# Altium project WS7.820.438.V01.PrjPCB (part 2 of 2)

## Sheet 4-RF-PD.SchDoc
size A2
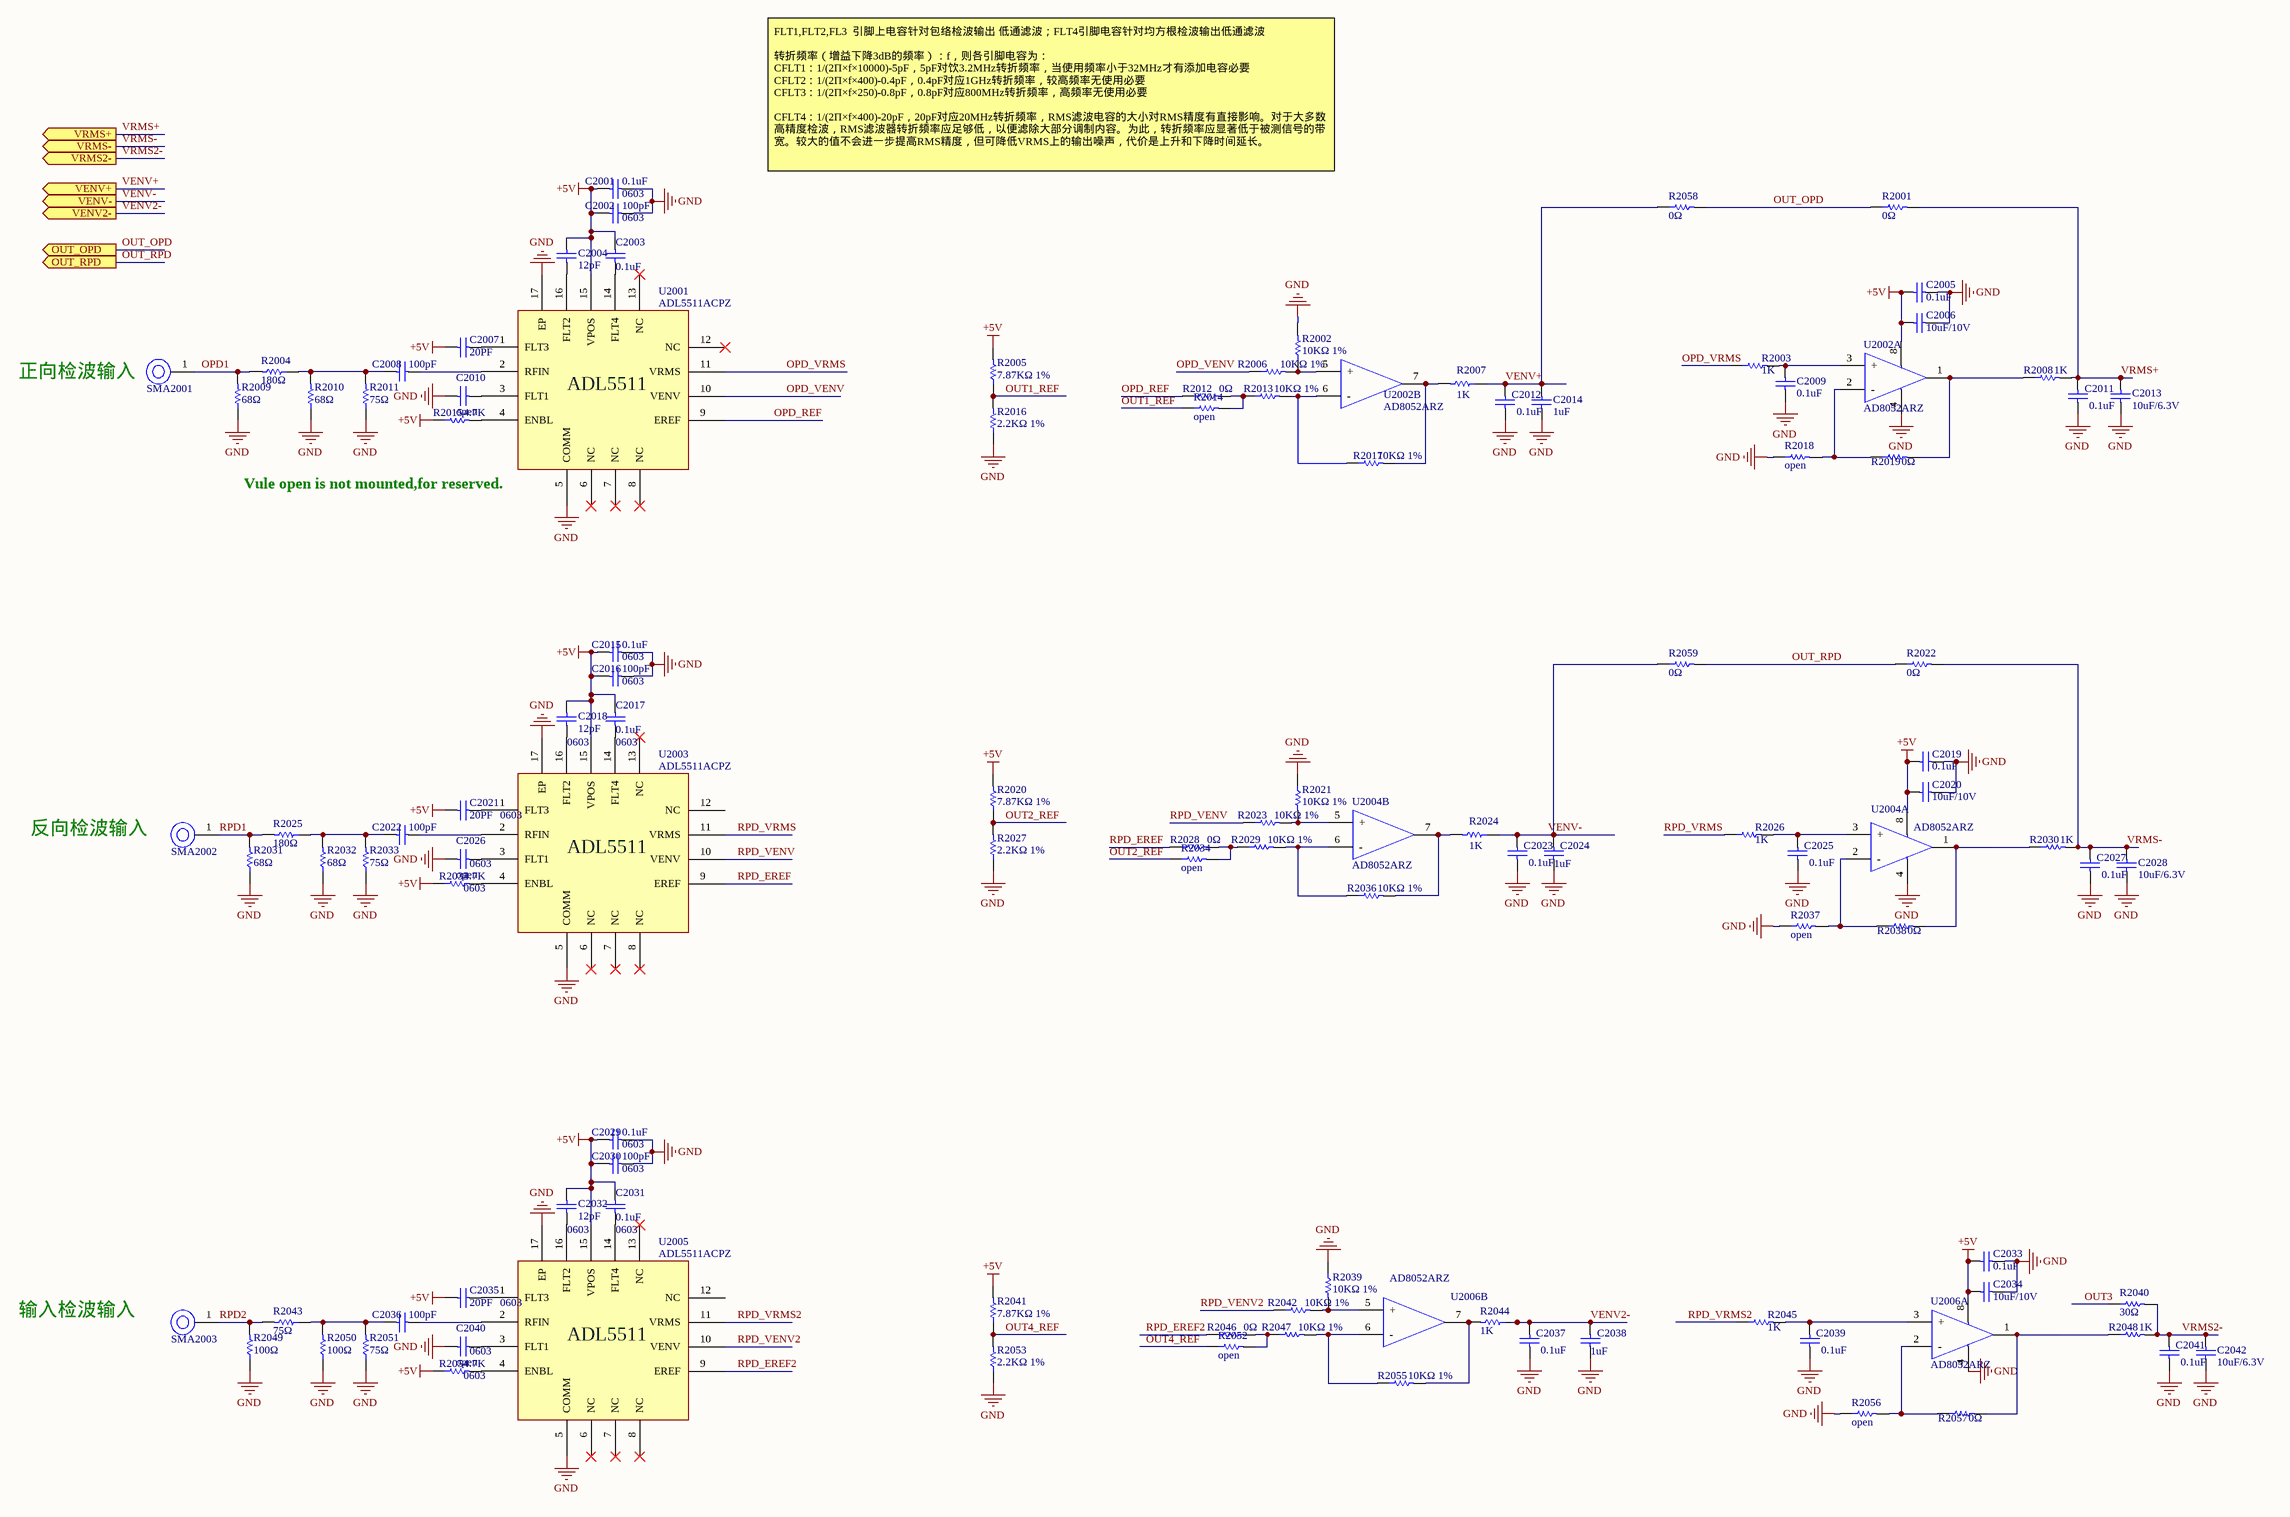
[diagram p10: 4-RF-PD.SchDoc]

### Parts
C2001  0.1uF  [C0603]
C2002  100pF  [C0603]
C2003  0.1uF  [C0603]
C2004  12pF  [C0603]
C2005  0.1uF  [C0603]
C2006  10uF/10V  [C0805]
C2007  20PF  [C0603]
C2008  100pF  [C0805]
C2009  0.1uF  [C0603]
C2010  open  [C0603]  (no BOM)
C2011  0.1uF  [C0603]
C2012  0.1uF  [C0603]
C2013  10uF/6.3V  [C0603]
C2014  1uF  [C0603]
C2015  0.1uF  [C0603]
C2016  100pF  [C0603]
C2017  0.1uF  [C0603]
C2018  12pF  [C0603]
C2019  0.1uF  [C0603]
C2020  10uF/10V  [C0805]
C2021  20PF  [C0603]
C2022  100pF  [C0805]
C2023  0.1uF  [C0603]
C2024  1uF  [C0603]
C2025  0.1uF  [C0603]
C2026  open  [C0603]  (no BOM)
C2027  0.1uF  [C0603]
C2028  10uF/6.3V  [C0603]
C2029  0.1uF  [C0603]
C2030  100pF  [C0603]
C2031  0.1uF  [C0603]
C2032  12pF  [C0603]
C2033  0.1uF  [C0603]
C2034  10uF/10V  [C0805]
C2035  20PF  [C0603]
C2036  100pF  [C0805]
C2037  0.1uF  [C0603]
C2038  1uF  [C0603]
C2039  0.1uF  [C0603]
C2040  open  [C0603]  (no BOM)
C2041  0.1uF  [C0603]
C2042  10uF/6.3V  [C0603]
R2001  0Ω  [R0603]  (no BOM)
R2002  10KΩ 1%  [R0603]
R2003  1K  [R0603]
R2004  180Ω  [R1206]
R2005  7.87KΩ 1%  [R0603]
R2006  10KΩ 1%  [R0603]
R2007  1K  [R0603]
R2008  1K  [R0603]
R2009  68Ω  [R1206]
R2010  68Ω  [R1206]
R2011  75Ω  [R0805]
R2012  0Ω  [R0603]
R2013  10KΩ 1%  [R0603]
R2014  open  [R0603]  (no BOM)
R2015  4.7K  [R0603]
R2016  2.2KΩ 1%  [R0603]
R2017  10KΩ 1%  [R0603]
R2018  open  [R0603]  (no BOM)
R2019  0Ω  [R0603]
R2020  7.87KΩ 1%  [R0603]
R2021  10KΩ 1%  [R0603]
R2022  0Ω  [R0603]  (no BOM)
R2023  10KΩ 1%  [R0603]
R2024  1K  [R0603]
R2025  180Ω  [R1206]
R2026  1K  [R0603]
R2027  2.2KΩ 1%  [R0603]
R2028  0Ω  [R0603]
R2029  10KΩ 1%  [R0603]
R2030  1K  [R0603]
R2031  68Ω  [R1206]
R2032  68Ω  [R1206]
R2033  75Ω  [R0805]
R2034  open  [R0603]  (no BOM)
R2035  4.7K  [R0603]
R2036  10KΩ 1%  [R0603]
R2037  open  [R0603]  (no BOM)
R2038  0Ω  [R0603]
R2039  10KΩ 1%  [R0603]
R2040  30Ω  [R0603]
R2041  7.87KΩ 1%  [R0603]
R2042  10KΩ 1%  [R0603]
R2043  75Ω  [R1206]
R2044  1K  [R0603]
R2045  1K  [R0603]
R2046  0Ω  [R0603]
R2047  10KΩ 1%  [R0603]
R2048  1K  [R0603]
R2049  100Ω  [R1206]
R2050  100Ω  [R1206]
R2051  75Ω  [R0805]
R2052  open  [R0603]  (no BOM)
R2053  2.2KΩ 1%  [R0603]
R2054  4.7K  [R0603]
R2055  10KΩ 1%  [R0603]
R2056  open  [R0603]  (no BOM)
R2057  0Ω  [R0603]
R2058  0Ω  [R0603]
R2059  0Ω  [R0603]
SMA2001  SMA-50KFD-4  [SMA-50KFD-4]  (value not drawn)  (no BOM)
SMA2002  SMA-50KFD-4  [SMA-50KFD-4]  (value not drawn)  (no BOM)
SMA2003  SMA-50KFD-4  [SMA-50KFD-4]  (value not drawn)  (no BOM)
U2001  ADL5511ACPZ  [QFN16_0R50_3X3]
U2002  AD8052ARZ  [SOIC8_1R27_3R9x4R9]  (parts A,B of 2)
U2003  ADL5511ACPZ  [QFN16_0R50_3X3]
U2004  AD8052ARZ  [SOIC8_1R27_3R9x4R9]  (parts A,B of 2)
U2005  ADL5511ACPZ  [QFN16_0R50_3X3]
U2006  AD8052ARZ  [SOIC8_1R27_3R9x4R9]  (parts A,B of 2)

### Ports
OUT_OPD (out), OUT_RPD (out), VENV2- (out), VENV+ (out), VENV- (out), VRMS2- (out), VRMS+ (out), VRMS- (out)

### Nets
+5V: C2001.2 C2002.1 C2003.2 C2004.2 C2005.1 C2006.1 C2007.1 C2015.2 C2016.1 C2017.2 C2018.2 C2019.1 C2020.1 C2021.1 C2029.2 C2030.1 C2031.2 C2032.2 C2033.1 C2034.1 C2035.1 R2005.2 R2015.1 R2020.2 R2035.1 R2041.2 R2054.1 U2001.15(VPOS) U2002.8 U2003.15(VPOS) U2004.8 U2005.15(VPOS) U2006.8
GND: C2001.1 C2002.2 C2005.2 C2006.2 C2009.1 C2010.1 C2011.1 C2012.1 C2013.1 C2014.1 C2015.1 C2016.2 C2019.2 C2020.2 C2023.1 C2024.1 C2025.1 C2026.1 C2027.1 C2028.1 C2029.1 C2030.2 C2033.2 C2034.2 C2037.1 C2038.1 C2039.1 C2040.1 C2041.1 C2042.1 R2002.2 R2009.1 R2010.1 R2011.1 R2016.1 R2018.1 R2021.1 R2027.1 R2031.1 R2032.1 R2033.1 R2037.1 R2039.1 R2049.1 R2050.1 R2051.1 R2053.1 R2056.1 U2001.5(COMM) U2001.17(EP) U2002.4 U2003.5(COMM) U2003.17(EP) U2004.4 U2005.5(COMM) U2005.17(EP) U2006.4
OPD1: R2004.2 R2009.2 SMA2001.1(Sig)
OPD_REF: R2012.1 U2001.9(EREF)
OPD_VENV: R2006.1 U2001.10(VENV)
OPD_VRMS: R2003.1 U2001.11(VRMS)
OUT1_REF: R2005.1 R2014.1 R2016.2
OUT2_REF: R2020.1 R2027.2 R2034.1
OUT3: R2040.1
OUT4_REF: R2041.1 R2052.1 R2053.2
OUT_OPD: R2001.1 R2058.2 ; port OUT_OPD
OUT_RPD: R2022.1 R2059.2 ; port OUT_RPD
RPD1: R2025.2 R2031.2 SMA2002.1(Sig)
RPD2: R2043.2 R2049.2 SMA2003.1(Sig)
RPD_EREF: R2028.1 U2003.9(EREF)
RPD_EREF2: R2046.1 U2005.9(EREF)
RPD_VENV: R2023.1 U2003.10(VENV)
RPD_VENV2: R2042.1 U2005.10(VENV)
RPD_VRMS: R2026.1 U2003.11(VRMS)
RPD_VRMS2: R2045.1 U2005.11(VRMS)
VENV2-: C2037.2 C2038.2 R2044.1 ; port VENV2-
VENV+: C2012.2 C2014.2 R2007.1 R2058.1 ; port VENV+
VENV-: C2023.2 C2024.2 R2024.1 R2059.1 ; port VENV-
VRMS2-: C2041.2 C2042.2 R2040.2 R2048.2 ; port VRMS2-
VRMS+: C2011.2 C2013.2 R2001.2 R2008.2 ; port VRMS+
VRMS-: C2027.2 C2028.2 R2022.2 R2030.2 ; port VRMS-
NetC2003_1: C2003.1 U2001.14(FLT4)
NetC2004_1: C2004.1 U2001.16(FLT2)
NetC2007_2: C2007.2 U2001.1(FLT3)
NetC2008_1: C2008.1 R2004.1 R2010.2 R2011.2
NetC2008_2: C2008.2 U2001.2(RFIN)
NetC2009_2: C2009.2 R2003.2 U2002.3(+)
NetC2010_2: C2010.2 U2001.3(FLT1)
NetC2017_1: C2017.1 U2003.14(FLT4)
NetC2018_1: C2018.1 U2003.16(FLT2)
NetC2021_2: C2021.2 U2003.1(FLT3)
NetC2022_1: C2022.1 R2025.1 R2032.2 R2033.2
NetC2022_2: C2022.2 U2003.2(RFIN)
NetC2025_2: C2025.2 R2026.2 U2004.3(+)
NetC2026_2: C2026.2 U2003.3(FLT1)
NetC2031_1: C2031.1 U2005.14(FLT4)
NetC2032_1: C2032.1 U2005.16(FLT2)
NetC2035_2: C2035.2 U2005.1(FLT3)
NetC2036_1: C2036.1 R2043.1 R2050.2 R2051.2
NetC2036_2: C2036.2 U2005.2(RFIN)
NetC2039_2: C2039.2 R2045.2 U2006.3(+)
NetC2040_2: C2040.2 U2005.3(FLT1)
NetR2002_1: R2002.1 R2006.2 U2002.5(+)
NetR2007_2: R2007.2 R2017.2 U2002.7
NetR2008_1: R2008.1 R2019.2 U2002.1
NetR2012_2: R2012.2 R2013.1 R2014.2
NetR2013_2: R2013.2 R2017.1 U2002.6(-)
NetR2015_2: R2015.2 U2001.4(ENBL)
NetR2018_2: R2018.2 R2019.1 U2002.2(-)
NetR2021_2: R2021.2 R2023.2 U2004.5(+)
NetR2024_2: R2024.2 R2036.2 U2004.7
NetR2028_2: R2028.2 R2029.1 R2034.2
NetR2029_2: R2029.2 R2036.1 U2004.6(-)
NetR2030_1: R2030.1 R2038.2 U2004.1
NetR2035_2: R2035.2 U2003.4(ENBL)
NetR2037_2: R2037.2 R2038.1 U2004.2(-)
NetR2039_2: R2039.2 R2042.2 U2006.5(+)
NetR2044_2: R2044.2 R2055.2 U2006.7
NetR2046_2: R2046.2 R2047.1 R2052.2
NetR2047_2: R2047.2 R2055.1 U2006.6(-)
NetR2048_1: R2048.1 R2057.2 U2006.1
NetR2054_2: R2054.2 U2005.4(ENBL)
NetR2056_2: R2056.2 R2057.1 U2006.2(-)

Not connected (* = marked no-connect by the designer): U2001 6(NC)* 7(NC)* 8(NC)* 12(NC)* 13(NC)*; U2003 6(NC)* 7(NC)* 8(NC)* 12(NC) 13(NC)*; U2005 6(NC)* 7(NC)* 8(NC)* 12(NC) 13(NC)*

### Notes on the sheet
- FLT1,FLT2,FL3  引脚上电容针对包络检波输出 低通滤波；FLT4引脚电容针对均方根检波输出低通滤波
  转折频率（增益下降3dB的频率）：f，则各引脚电容为：
  CFLT1：1/(2Π×f×10000)-5pF，5pF对饮3.2MHz转折频率，当使用频率小于32MHz才有添加电容必要
  CFLT2：1/(2Π×f×400)-0.4pF，0.4pF对应1GHz转折频率，较高频率无使用必要
  CFLT3：1/(2Π×f×250)-0.8pF，0.8pF对应800MHz转折频率，高频率无使用必要
  CFLT4：1/(2Π×f×400)-20pF，20pF对应20MHz转折频率，RMS滤波电容的大小对RMS精度有直接影响。对于大多数高精度检波，RMS滤波器转折频率应足够低，以便滤除大部分调制内容。为此，转折频率应显著低于被测信号的带宽。较大的值不会进一步提高RMS精度，但可降低VRMS上的输出噪声，代价是上升和下降时间延长。
- (near C2002) 0603
- (near C2001) 0603
- 正向检波输入
- (near U2001) Vule open is not mounted,for reserved.
- (near C2015) 0603
- (near C2016) 0603
- (near C2018) 0603
- (near C2017) 0603
- 反向检波输入
- (near U2003) 0603
- (near R2035) 0603
- (near C2026) 0603
- (near C2029) 0603
- (near C2030) 0603
- (near C2032) 0603
- (near C2031) 0603
- 输入检波输入
- (near U2005) 0603
- (near R2054) 0603
- (near C2040) 0603
- (in symbol ADL5511ACPZ) ADL5511

### Library data of the parts
C2001 C2003 C2005 C2009 C2011 C2012 C2015 C2017 C2019 C2023 C2025 C2027 C2029 C2031 C2033 C2037 C2039 C2041 = 0.1uF贴片电容: 贴片电容_GRM188R71H104KA01D_0.1uF±10%,50V,0603; code: 01010045
C2002 C2016 C2030 = 1000pF贴片电容: 贴片电容_100pF±10%,50V,0603
C2004 C2018 C2032 = 10pF贴片电容: GRM1885C1H390JA01D_39pF±5%,50V,0603; code: 01010157
C2006 C2020 C2034 = 10uF贴片电容: 贴片电容_GRM21BR61A106KE19L_10uF±10%,10V,0805; code: 01010036
C2007 C2021 C2035 = 10pF贴片电容: 贴片电容_GRM1885C1H680JA01D_0603,68PF,50V,±5％,COG; MPN: Murata; code: 01010034
C2008 C2022 C2036 = 100pF贴片电容: 贴片电容_GRM2165C1H101JA01D_100pF±5%,50V,0805; code: 01010043
C2010 C2026 C2040 = 1000pF贴片电容: 贴片电容_GRM188R71H102KA01_1000pF±10%,50V,0603; code: 01010093
C2013 C2028 C2042 = 10uF贴片电容: 贴片电容_GRM188R60J106ME47D_10uF±20%,6.3V,0603; code: 01010037
C2014 C2024 C2038 = 10uF贴片电容: code: 01010037
R2001 R2007 R2022 R2024 R2040 R2044 R2058 R2059 = 0Ω贴片电阻: code: 01020010
R2002 R2006 R2013 R2017 R2021 R2023 R2029 R2036 R2039 R2042 R2047 R2055 = 430Ω贴片电阻: code: 01020118
R2003 R2026 R2045 = 1K贴片电阻: 贴片电阻_1K±5%,0603; code: 01020082
R2004 R2025 = 56Ω贴片电阻: 贴片电阻_1206,180Ω,±5％
R2005 R2020 R2041 = 0Ω贴片电阻: 0603,7.87KΩ,±1％; code: 01020010
R2008 R2012 R2014 R2019 R2028 R2030 R2034 R2038 R2046 R2048 R2052 R2057 = 0Ω贴片电阻: 贴片电阻_0Ω±5%,0603; code: 01020010
R2009 R2010 R2031 R2032 = 56Ω贴片电阻: 贴片电阻_68Ω±5%,1206
R2011 R2033 R2051 = 75Ω贴片电阻: 贴片电阻_75Ω±5%,0805; code: 01020068
R2015 R2035 R2054 = 4.7K贴片电阻: 贴片电阻_4.7K±5%,0603; code: 01020012
R2016 R2027 R2053 = 0Ω贴片电阻: 0603,2.2KΩ,±1％; code: 01020010
R2018 R2037 R2056 = 0Ω贴片电阻
R2043 = 56Ω贴片电阻: 贴片电阻_75Ω±5%,1206
R2049 R2050 = 56Ω贴片电阻: 贴片电阻_100Ω±5%,1206
SMA2001-SMA2003 = SMA-50KFD-4: 射频同轴连接器_SMA-50KFD-4; code: 03100009
U2001 U2003 U2005 = ADL5511ACPZ: 检波器_ADL5511ACPZ_DC~6GHz,LFCSP16; code: 01060108
U2002 U2006 = OP284: Maker: TI; code: 01060201
U2004 = LM358: 运算放大器_LM358_SOIC8; Maker: MOTOROLA; code: 01060025

## Sheet 5-POWER.SchDoc
size A3
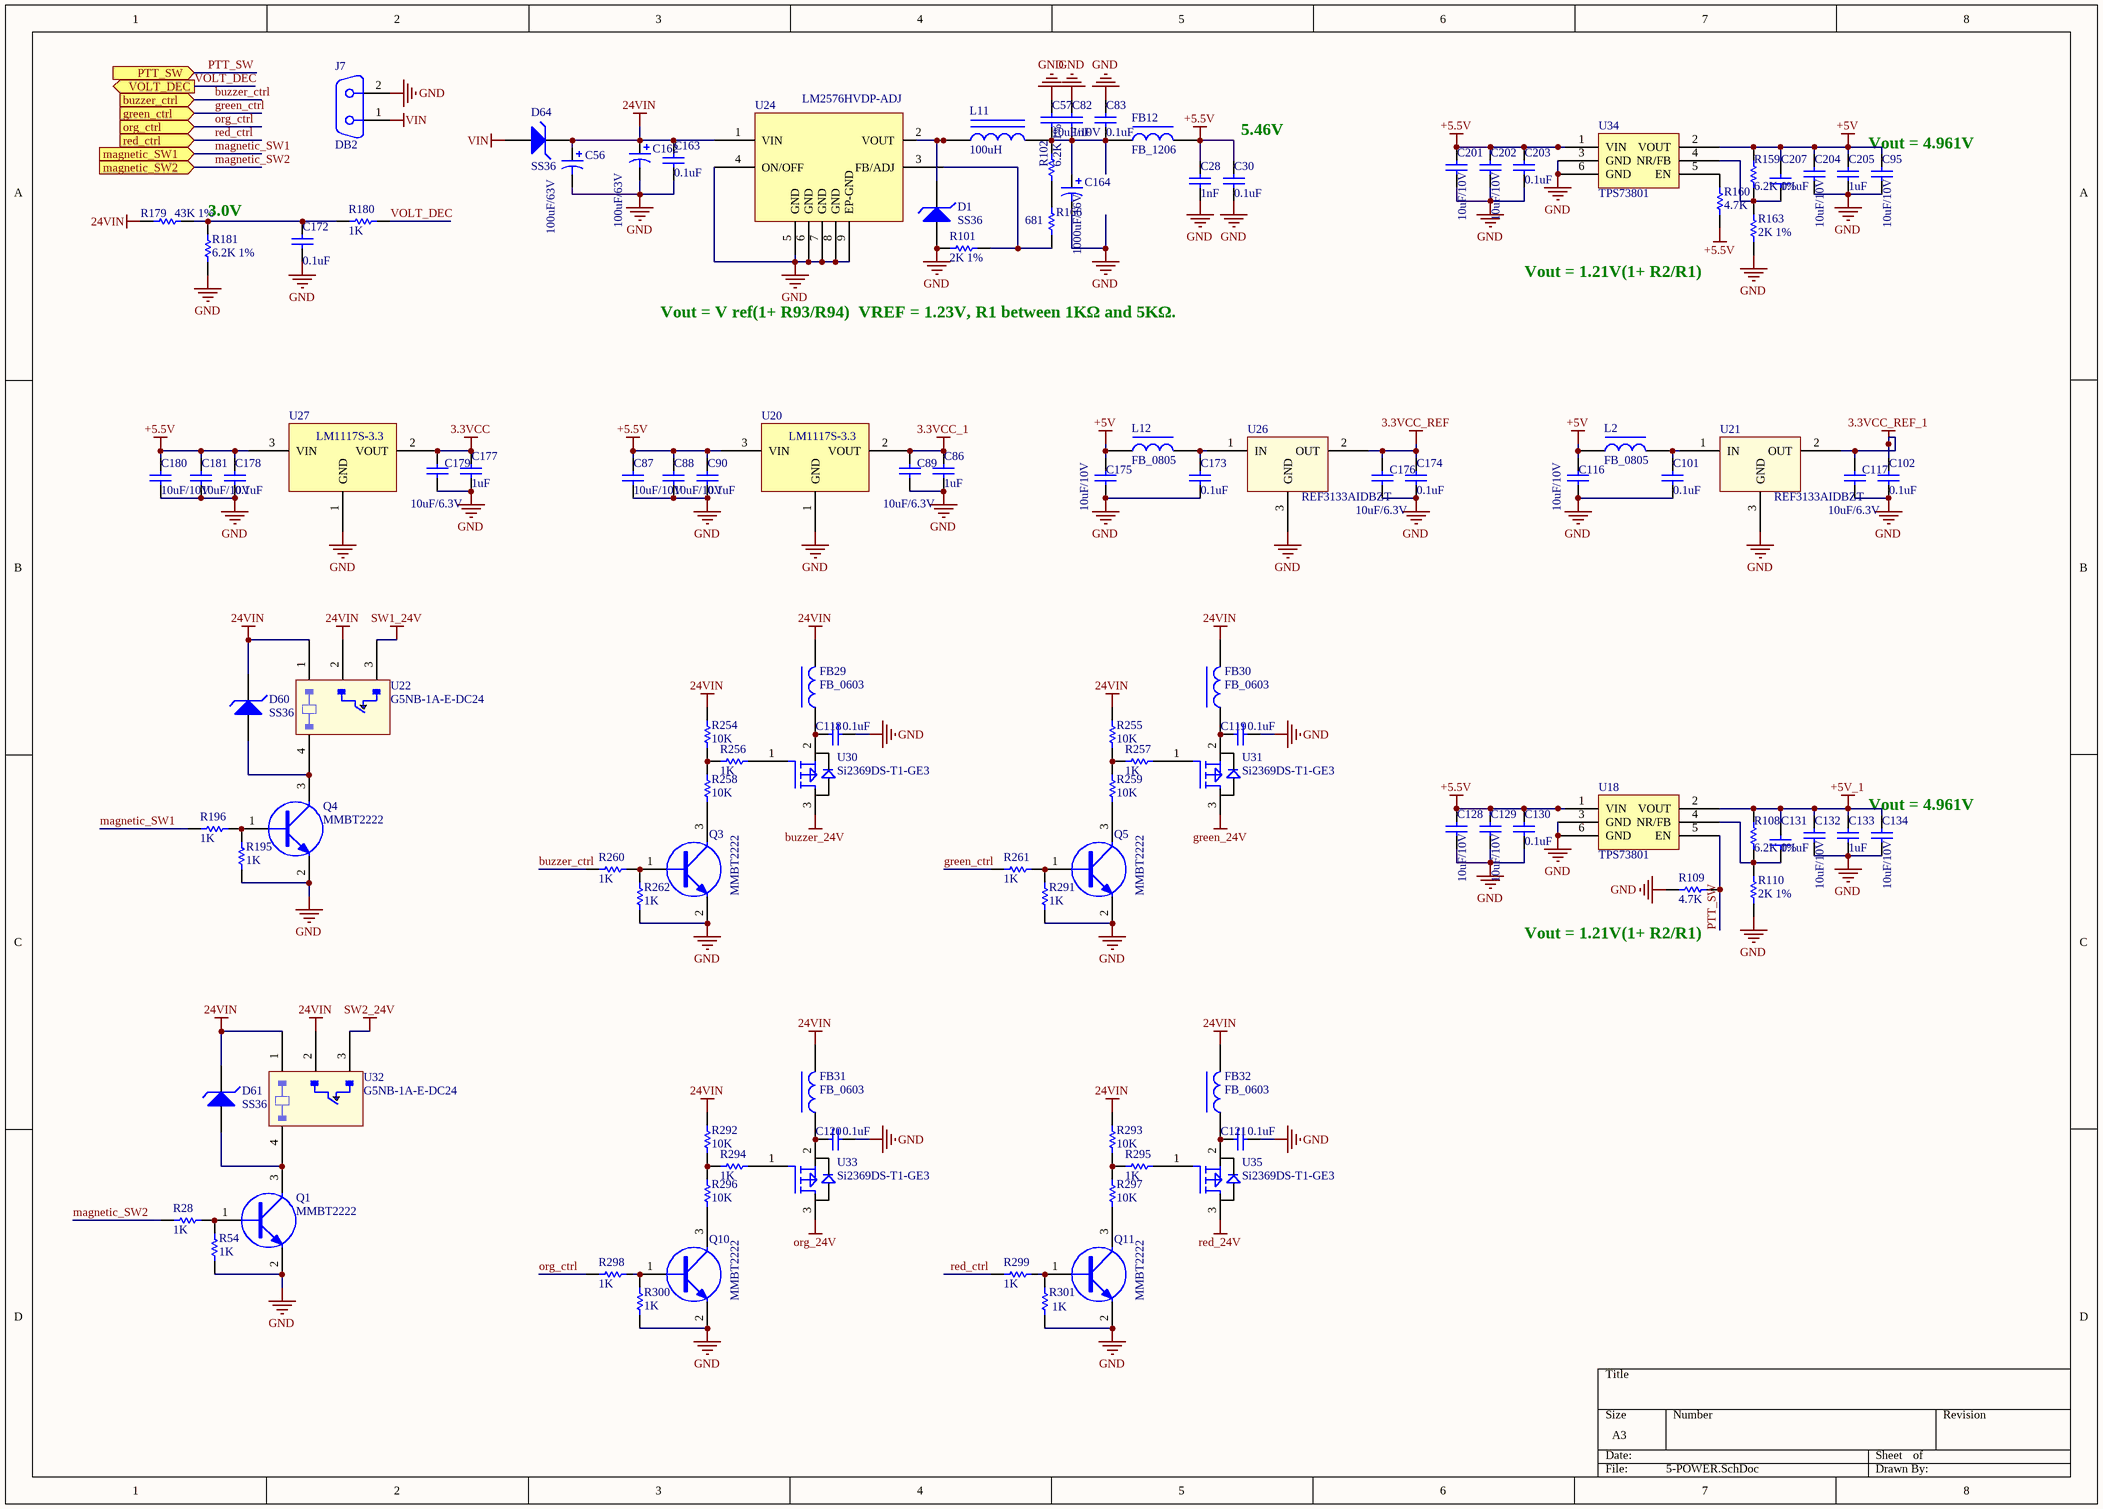
[diagram p11: 5-POWER.SchDoc]

### Parts
C28  1nF  [C0603]
C30  0.1uF  [C0603]
C56  100uF/63V  [ECAP2SM_10R4x10R4]
C57  10uF/10V  [C0805]
C82  1nF  [C0603]
C83  0.1uF  [C0603]
C86  1uF  [C0603]
C87  10uF/10V  [C0805]
C88  10uF/10V  [C0805]
C89  10uF/6.3V  [C0603]
C90  0.1uF  [C0603]
C95  10uF/10V  [C0805]
C101  0.1uF  [C0603]
C102  0.1uF  [C0603]
C116  10uF/10V  [C0805]
C117  10uF/6.3V  [C0603]
C118  0.1uF  [C0603]
C119  0.1uF  [C0603]
C120  0.1uF  [C0603]
C121  0.1uF  [C0603]
C128  10uF/10V  [C0805]
C129  10uF/10V  [C0805]
C130  0.1uF  [C0603]
C131  0.1uF  [C0603]
C132  10uF/10V  [C0805]
C133  1uF  [C0603]
C134  10uF/10V  [C0805]
C162  100uF/63V  [ECAP2SM_10R4x10R4]
C163  0.1uF  [C0603]
C164  1000uF/16V  [ECAP2SM_10R4x10R4]
C172  0.1uF  [C0603]
C173  0.1uF  [C0603]
C174  0.1uF  [C0603]
C175  10uF/10V  [C0805]
C176  10uF/6.3V  [C0603]
C177  1uF  [C0603]
C178  0.1uF  [C0603]
C179  10uF/6.3V  [C0603]
C180  10uF/10V  [C0805]
C181  10uF/10V  [C0805]
C201  10uF/10V  [C0805]
C202  10uF/10V  [C0805]
C203  0.1uF  [C0603]
C204  10uF/10V  [C0805]
C205  1uF  [C0603]
C207  0.1uF  [C0603]
D1  SS36  [DO-214AC]
D60  SS36  [DO-214AC]
D61  SS36  [DO-214AC]
D64  SS36  [DO-214AC]
FB12  FB_1206  [L1206]
FB29  FB_0603  [L0603]
FB30  FB_0603  [L0603]
FB31  FB_0603  [L0603]
FB32  FB_0603  [L0603]
J7  DB2  [DB2TM-VM]  (no BOM)
L2  FB_0805  [L0805]
L11  100uH  [PL2SM-12R5x12R5]
L12  FB_0805  [L0805]
Q1  MMBT2222  [SOT23-3]
Q3  MMBT2222  [SOT23-3]
Q4  MMBT2222  [SOT23-3]
Q5  MMBT2222  [SOT23-3]
Q10  MMBT2222  [SOT23-3]
Q11  MMBT2222  [SOT23-3]
R28  1K  [R0603]
R54  1K  [R0603]
R101  2K 1%  [R0603]
R102  6.2K 1%  [R0603]
R108  6.2K 1%  [R0603]
R109  4.7K  [R0603]
R110  2K 1%  [R0603]
R159  6.2K 1%  [R0603]
R160  4.7K  [R0603]
R163  2K 1%  [R0603]
R166  681  [R0603]
R179  43K 1%  [R0603]
R180  1K  [R0603]
R181  6.2K 1%  [R0603]
R195  1K  [R0603]
R196  1K  [R0603]
R254  10K  [R0603]
R255  10K  [R0603]
R256  1K  [R0603]
R257  1K  [R0603]
R258  10K  [R0603]
R259  10K  [R0603]
R260  1K  [R0603]
R261  1K  [R0603]
R262  1K  [R0603]
R291  1K  [R0603]
R292  10K  [R0603]
R293  10K  [R0603]
R294  1K  [R0603]
R295  1K  [R0603]
R296  10K  [R0603]
R297  10K  [R0603]
R298  1K  [R0603]
R299  1K  [R0603]
R300  1K  [R0603]
R301  1K  [R0603]
U18  TPS73801  [SOT-223-6]
U20  LM1117S-3.3  [SOT-223]
U21  REF3133AIDBZT  [SOT23-3]
U22  G5NB-1A-E-DC24  [G5NB-1A-E-DC24-20R4X7]
U24  LM2576HVDP-ADJ  [SOIC8_1R27_3R9x4R9-1]
U26  REF3133AIDBZT  [SOT23-3]
U27  LM1117S-3.3  [SOT-223]
U30  Si2369DS-T1-GE3  [SOT23-3]
U31  Si2369DS-T1-GE3  [SOT23-3]
U32  G5NB-1A-E-DC24  [G5NB-1A-E-DC24-20R4X7]
U33  Si2369DS-T1-GE3  [SOT23-3]
U34  TPS73801  [SOT-223-6]
U35  Si2369DS-T1-GE3  [SOT23-3]

### Ports
buzzer_ctrl (in), green_ctrl (in), magnetic_SW1 (in), magnetic_SW2 (in), org_ctrl (in), PTT_SW (in), red_ctrl (in), VOLT_DEC (out)

### Nets
3.3VCC: C177.2 C179.2 U27.2(VOUT)
3.3VCC_1: C86.2 C89.2 U20.2(VOUT)
3.3VCC_REF: C174.2 C176.2 U26.2(OUT)
3.3VCC_REF_1: C102.2 C117.2 U21.2(OUT)
24VIN: C56.1 C162.1 C163.2 D60.2(K) D61.2(K) D64.2(K) FB29.2 FB30.2 FB31.2 FB32.2 R179.1 R254.2 R255.2 R292.2 R293.2 U22.1 U22.2 U24.1(VIN) U32.1 U32.2
+5.5V: C28.2 C30.2 C87.2 C88.2 C90.2 C128.2 C129.2 C130.2 C178.2 C180.2 C181.2 C201.2 C202.2 C203.2 FB12.2 R160.2 U18.1(VIN) U20.3(VIN) U27.3(VIN) U34.1(VIN)
+5V: C95.2 C116.2 C175.2 C204.2 C205.2 C207.2 L2.1 L12.1 R159.2 U34.2(VOUT)
+5V_1: C131.2 C132.2 C133.2 C134.2 R108.2 U18.2(VOUT)
buzzer_24V: U30.3(D)
GND: C28.1 C30.1 C56.2 C57.2 C82.2 C83.2 C86.1 C87.1 C88.1 C89.1 C90.1 C95.1 C101.1 C102.1 C116.1 C117.1 C118.1 C119.1 C120.1 C121.1 C128.1 C129.1 C130.1 C132.1 C133.1 C134.1 C162.2 C163.1 C164.2 C172.1 C173.1 C174.1 C175.1 C176.1 C177.1 C178.1 C179.1 C180.1 C181.1 C201.1 C202.1 C203.1 C204.1 C205.1 D1.1(A) J7.2 Q1.2(E) Q3.2(E) Q4.2(E) Q5.2(E) Q10.2(E) Q11.2(E) R54.1 R101.2 R109.1 R110.1 R163.1 R181.1 R195.1 R262.2 R291.2 R300.2 R301.2 U18.3(GND) U18.6(GND) U20.1(GND) U21.3(GND) U24.4(ON/OFF) U24.5(GND) U24.6(GND) U24.7(GND) U24.8(GND) U24.9(EP-GND) U26.3(GND) U27.1(GND) U34.3(GND) U34.6(GND)
green_24V: U31.3(D)
org_24V: U33.3(D)
red_24V: U35.3(D)
SW1_24V: U22.3
SW2_24V: U32.3
VIN: D64.1(A) J7.1
buzzer_ctrl: R260.1 ; port buzzer_ctrl
green_ctrl: R261.1 ; port green_ctrl
magnetic_SW1: R196.1 ; port magnetic_SW1
magnetic_SW2: R28.1 ; port magnetic_SW2
org_ctrl: R298.1 ; port org_ctrl
PTT_SW: R109.2 U18.5(EN) ; port PTT_SW
red_ctrl: R299.1 ; port red_ctrl
VOLT_DEC: R180.1 ; port VOLT_DEC
NetC57_1: C57.1 C82.1 C83.1 C164.1 FB12.1 L11.2 R102.2
NetC101_2: C101.2 L2.2 U21.1(IN)
NetC118_2: C118.2 FB29.1 U30.2(S)
NetC119_2: C119.2 FB30.1 U31.2(S)
NetC120_2: C120.2 FB31.1 U33.2(S)
NetC121_2: C121.2 FB32.1 U35.2(S)
NetC131_1: C131.1 R108.1 R110.2 U18.4(NR/FB)
NetC172_2: C172.2 R179.2 R180.2 R181.2
NetC173_2: C173.2 L12.2 U26.1(IN)
NetC207_1: C207.1 R159.1 R163.2 U34.4(NR/FB)
NetD1_2: D1.2(K) L11.1 U24.2(VOUT)
NetD60_1: D60.1(A) Q4.3(C) U22.4
NetD61_1: D61.1(A) Q1.3(C) U32.4
NetQ1_1: Q1.1(B) R28.2 R54.2
NetQ3_1: Q3.1(B) R260.2 R262.1
NetQ3_3: Q3.3(C) R258.1
NetQ4_1: Q4.1(B) R195.2 R196.2
NetQ5_1: Q5.1(B) R261.2 R291.1
NetQ5_3: Q5.3(C) R259.1
NetQ10_1: Q10.1(B) R298.2 R300.1
NetQ10_3: Q10.3(C) R296.1
NetQ11_1: Q11.1(B) R299.2 R301.1
NetQ11_3: Q11.3(C) R297.1
NetR101_1: R101.1 R166.1 U24.3(FB/ADJ)
NetR102_1: R102.1 R166.2
NetR160_1: R160.1 U34.5(EN)
NetR254_1: R254.1 R256.1 R258.2
NetR255_1: R255.1 R257.1 R259.2
NetR256_2: R256.2 U30.1(G)
NetR257_2: R257.2 U31.1(G)
NetR292_1: R292.1 R294.1 R296.2
NetR293_1: R293.1 R295.1 R297.2
NetR294_2: R294.2 U33.1(G)
NetR295_2: R295.2 U35.1(G)

### Notes on the sheet
- 5.46V
- (near C95) Vout = 4.961V
- (near R181) 3.0V
- Vout = V ref(1+ R93/R94)  VREF = 1.23V, R1 between 1KΩ and 5KΩ.
- Vout = 1.21V(1+ R2/R1)
- (near C134) Vout = 4.961V

### Library data of the parts
C28 C82 = 1000pF贴片电容: as C2010 on sheet 4-RF-PD
C30 C83 C118-C121 = 0.1uF: GRM188R71H104KA01D; MPN: MURATA; WSPN: 01010045
C56 C162 = 100uF/63V电解电容: 电解电容_VEJ101M1JTR-1010_100uF/63V,±20%,表贴10*10; code: 01080002
C57 C87 C88 C95 C116 C128 C129 C132 C134 C175 C180 C181 C201 C202 C204 = 10uF贴片电容: as C2006 on sheet 4-RF-PD
C86 C133 C177 C205 = 1uF贴片电容: 贴片电容_GRM188R61A105KA61D_1uF±10%,10V,0603; code: 01010038
C89 C117 C176 C179 = 10uF贴片电容: as C2013 on sheet 4-RF-PD
C90 C101 C102 C130 C131 C163 C172-C174 C178 C203 C207 = 0.1uF贴片电容: as C2001 on sheet 4-RF-PD
C164 = 1000uF/16V电解电容: 电解电容_VE102M1CTR-1010_1000uF/16V,±20%,表贴10*10; code: 01080003
D1 D60 D61 D64 = 肖特基整流二极管_SS36: 肖特基整流二极管_SS36_封装SMA,3A/60V; code: 01040003
FB12 = 1206贴片磁珠: 贴片磁珠_30R,6A,1206; code: 0103015
FB29-FB32 = 0603贴片磁珠: 贴片磁珠_100R,0603; code: 0103016
J7 = DB2公头座子: 连接器_DB2公头,电源接头; code: 0207001
L2 L12 = 0805贴片磁珠: 贴片磁珠_600R,0805; code: 01030023
L11 = 100uH贴片功率电感: 贴片功率电感_SLF12575T-101M1R9-PF_100uH±20%,额定电流1.9A,12.5x12.5; code: 01030003
Q1 Q3-Q5 Q10 Q11 = MMBT2222: NPN三极管_MMBT2222_表贴SOT23; code: 01050001
R28 R54 R180 R195 R196 R254-R262 R291-R301 = 1K贴片电阻: 贴片电阻_1K±5%,0603; code: 01020082
R101 R110 R163 = 2K贴片电阻: 贴片电阻_2K±5%,0603; code: 01020086
R102 R108 R159 = 6.2K贴片电阻: 贴片电阻_6.2K±5%,0603; code: 01020106
R109 R160 = 4.7K贴片电阻: 贴片电阻_4.7K±5%,0603; code: 01020012
R166 = 1.5K贴片电阻: 0603,681Ω,±1％; code: 01020063
R179 = 12.4K贴片电阻: 贴片电阻_12.4K±1%,0603; code: 01020125
R181 = 1.5K贴片电阻: 贴片电阻_1.5K±5%,0603; code: 01020063
U18 U34 = TPS73701DCQ: LDO_TPS73701DCQ_1A输出,SOT223-6; Maker: TI; code: *
U20 U27 = LM1117S-3.3: LDO_LM1117S-3.3_1A输出,SOT223; code: 01060031
U21 U26 = REF3133AIDBZT: LDO_REF3133AIDBZT_3.3V输出,10mA输出,SOT23-3; Maker: TI; code: 01060034
U22 U32 = G5NB-1A-E-DC24: 继电器_G5NB-1A-E-DC24
U24 = LM2576HVDP-ADJ: 稳压集成电路_LM2576HVDP-ADJ_3A输出,SOIC8; code: 03020005; Maker: HTC
U30 U31 U33 U35 = Si2369DS-T1-GE3: P-MOS_Si2369DS-T1-GE3_SOT23; code: 01060087

## Nets that join several sheets
3.3VCC: 1-MCU (108 pins), 3-ADC (36 pins), 5-POWER (C177.2 C179.2 U27.2)
3.3VCC_REF: 1-MCU (U16.32), 5-POWER (C174.2 C176.2 U26.2)
3.3VCC_REF_1: 3-ADC (U2.21), 5-POWER (C102.2 C117.2 U21.2)
24VIN: 1-MCU (FB1007.1 J3.B2 L1.1 R308.2), 5-POWER (20 pins)
+5V: 1-MCU (19 pins), 3-ADC (FB13.2 FB26.2), 4-RF-PD (33 pins), 5-POWER (10 pins)
+5V_1: 1-MCU (J9.1), 5-POWER (6 pins)
buzzer_24V: 1-MCU (J4.7), 5-POWER (U30.3)
GND: 1-MCU (257 pins), 3-ADC (39 pins), 4-RF-PD (57 pins), 5-POWER (77 pins)
green_24V: 1-MCU (J4.2), 5-POWER (U31.3)
org_24V: 1-MCU (J4.6), 5-POWER (U33.3)
red_24V: 1-MCU (J4.1), 5-POWER (U35.3)
SW1_24V: 1-MCU (J4.5), 5-POWER (U22.3)
SW2_24V: 1-MCU (J4.4), 5-POWER (U32.3)
buzzer_ctrl: 1-MCU (R173.2), 5-POWER (R260.1)
green_ctrl: 1-MCU (R106.2), 5-POWER (R261.1)
magnetic_SW1: 1-MCU (U16.7), 5-POWER (R196.1)
magnetic_SW2: 1-MCU (U16.8), 5-POWER (R28.1)
org_ctrl: 1-MCU (R223.2), 5-POWER (R298.1)
OUT_OPD: 3-ADC (U10.6), 4-RF-PD (R2001.1 R2058.2)
OUT_RPD: 3-ADC (U17.6), 4-RF-PD (R2022.1 R2059.2)
Port_D0: 1-MCU (R115.2), 3-ADC (U2.15)
Port_D1: 1-MCU (R123.2), 3-ADC (U2.16)
Port_D2: 1-MCU (R142.1), 3-ADC (U2.17)
Port_D3: 1-MCU (R141.1), 3-ADC (U2.18)
Port_D4: 1-MCU (R119.1), 3-ADC (U2.33)
Port_D5: 1-MCU (R113.1), 3-ADC (U2.34)
Port_D6: 1-MCU (R111.1), 3-ADC (U2.63)
Port_D7: 1-MCU (R100.1), 3-ADC (U2.64)
Port_D8: 1-MCU (R98.1), 3-ADC (U2.65)
Port_D9: 1-MCU (R95.1), 3-ADC (U2.66)
Port_D10: 1-MCU (R94.1), 3-ADC (U2.78)
Port_D11: 1-MCU (R59.1), 3-ADC (U2.79)
Port_D12: 1-MCU (R47.1), 3-ADC (U2.80)
Port_D13: 1-MCU (R27.1), 3-ADC (U2.7)
Port_D14: 1-MCU (R26.1), 3-ADC (U2.8)
Port_D15: 1-MCU (R20.1), 3-ADC (U2.9)
PTT_SW: 1-MCU (R176.2), 5-POWER (R109.2 U18.5)
red_ctrl: 1-MCU (R208.2), 5-POWER (R299.1)
VENV2-: 1-MCU (U16.22), 4-RF-PD (C2037.2 C2038.2 R2044.1)
VENV+: 1-MCU (U16.29), 4-RF-PD (C2012.2 C2014.2 R2007.1 R2058.1)
VENV-: 1-MCU (U16.27), 4-RF-PD (C2023.2 C2024.2 R2024.1 R2059.1)
VOLT_DEC: 1-MCU (U16.43), 5-POWER (R180.1)
VRMS2-: 1-MCU (U16.18), 4-RF-PD (C2041.2 C2042.2 R2040.2 R2048.2)
VRMS+: 1-MCU (U16.28), 4-RF-PD (C2011.2 C2013.2 R2001.2 R2008.2)
VRMS-: 1-MCU (U16.26), 4-RF-PD (C2027.2 C2028.2 R2022.2 R2030.2)